# EAGLE design car_sch (EAGLE 6.1)
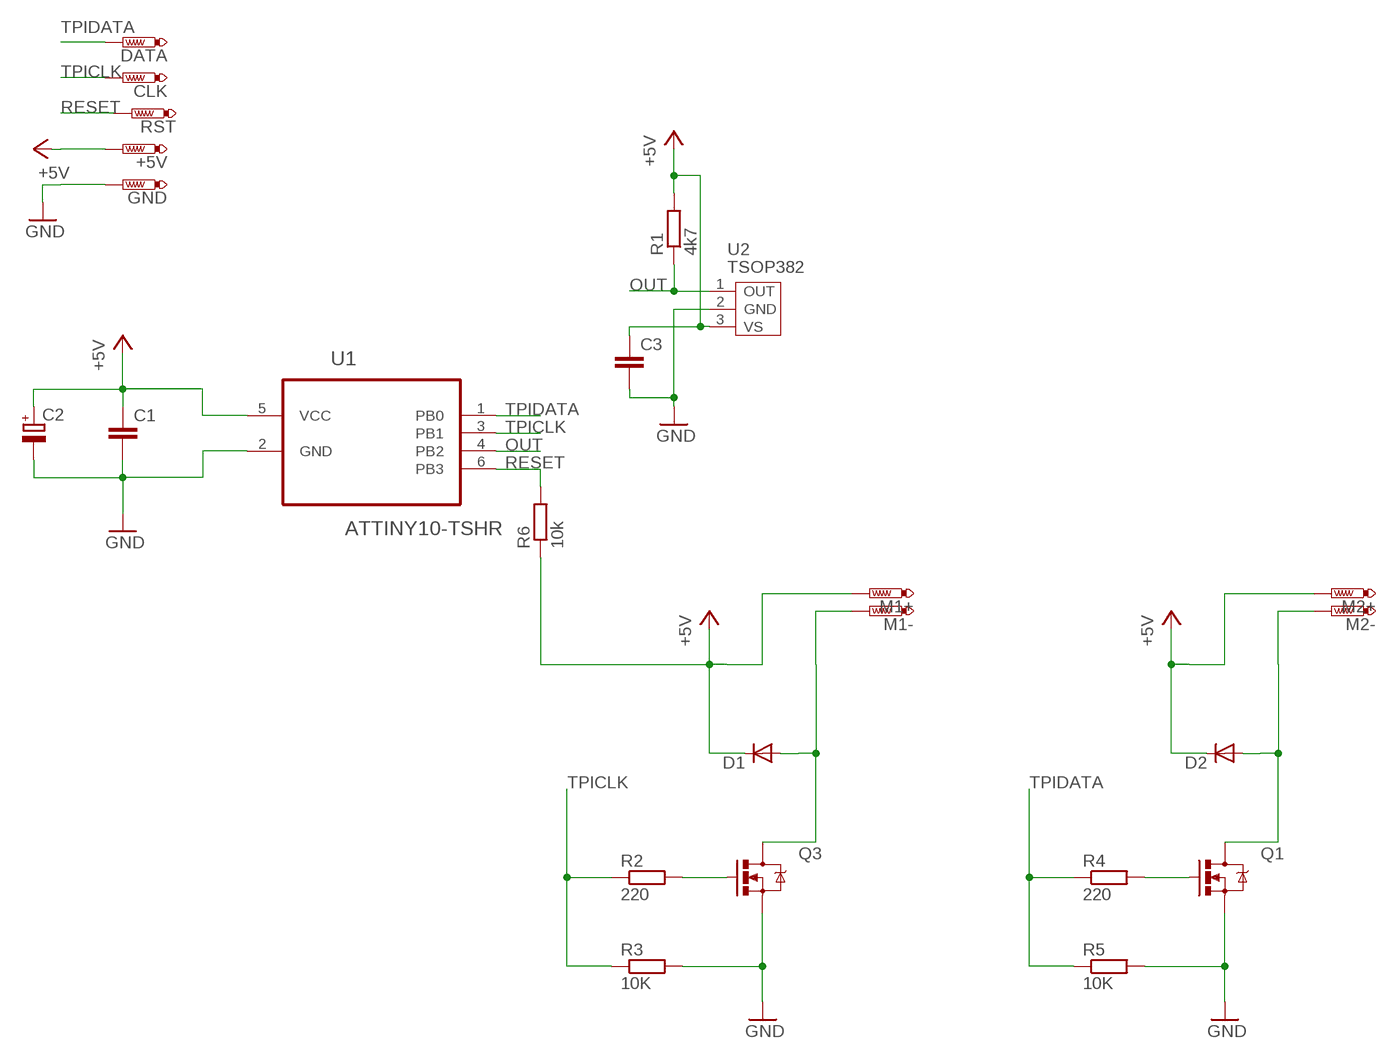
[diagram p0: schematic, sheet 1]

## Parts
+5V  PTR1TP11R  [TP11R]
C1  C-EUC0603  [C0603]
C2  CPOL-EUSMCA  [SMC_A]
C3  C-EUC0603  [C0603]
CLK  PTR1TP11R  [TP11R]
D1  DIODESOD  [SOD-323]
D2  DIODESOD  [SOD-323]
DATA  PTR1TP11R  [TP11R]
GND  PTR1TP11R  [TP11R]
M1+  PTR1TP11R  [TP11R]
M1-  PTR1TP11R  [TP11R]
M2+  PTR1TP11R  [TP11R]
M2-  PTR1TP11R  [TP11R]
Q1  MOSFET-NCHANNELBSS123LT1G  [SOT23]
Q3  MOSFET-NCHANNELBSS123LT1G  [SOT23]
R1  4k7  R-EU_R0603  [R0603]
R2  220  R-EU_R0603  [R0603]
R3  10K  R-EU_R0603  [R0603]
R4  220  R-EU_R0603  [R0603]
R5  10K  R-EU_R0603  [R0603]
R6  10k  R-EU_R0603  [R0603]
RST  PTR1TP11R  [TP11R]
U1  ATTINY10-TSHR  [SOT95P280X145-6N]
U2  TSOP382  [3P-2.54-4.8X5X6.95H]

## Nets
+5V: +5V.TP C1.1 C2.+ C3.1 D1.1(C) D2.1(C) M1+.TP M2+.TP R1.2 R6.1 U1.5(VCC) U2.3(VS)
GND: C1.2 C2.- C3.2 GND.TP Q1.2(S) Q3.2(S) R3.2 R5.2 U1.2(GND) U2.2(GND)
N$1: Q1.1(G) R4.2
N$2: D2.2(A) M2-.TP Q1.3(D)
N$4: Q3.1(G) R2.2
N$5: D1.2(A) M1-.TP Q3.3(D)
OUT: R1.1 U1.4(PB2) U2.1(OUT)
RESET: R6.2 RST.TP U1.6(PB3)
TPICLK: CLK.TP R2.1 R3.1 U1.3(PB1)
TPIDATA: DATA.TP R4.1 R5.1 U1.1(PB0)

## Library data of the parts
+5V CLK DATA GND M1+ M1- M2+ M2- RST = testpad:PTR1: TEST PIN
C1 C3 = resistor:C-EU: CAPACITOR, European symbol
C2 = resistor:CPOL-EU: POLARIZED CAPACITOR, European symbol
D1 D2 = SparkFun-DiscreteSemi:DIODE: Diode These are standard reverse protection diodes and small signal diodes. SMA package can handle up to about 1A. SOD-323 can handle about 200mA. What the SOD-323 package when ordering, there are some mfgs out there that are 5-pin packages.; PROD_ID: DIO-09646
Q1 Q3 = SparkFun-DiscreteSemi:MOSFET-NCHANNEL: Common NMOSFET Parts MFG P/N Store ID Prod ID FDD8780 TRANS-09984 SI7820DN TRANS-11055 FDS6630A IC-08089 2N7002PW TRANS-11151 FQP30N06L COM-10213 TRANS-10060 BSS123LT1G TRANS-08345 BSS138 TRANS-00830 BS170 2N7000; PROD_ID: TRANS-08345
R1-R6 = resistor:R-EU_: RESISTOR, European symbol
U1 = Atmel_By_element14_Batch_1:ATTINY10-TSHR: 8-bit Microcontroller with In-System Programmable Flash; MPN: ATTINY10-TSHR; OC_FARNELL: 1748538; OC_NEWARK: 26R5645; PACKAGE: SOT-23-6; SUPPLIER: Atmel
U2 = IC:TSOP382: IR Receiver Modules for Remote Control Systems

## Board
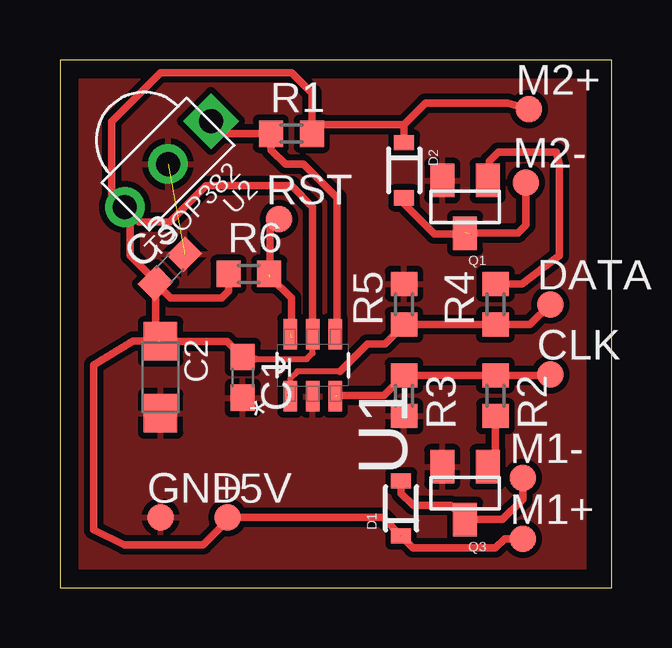
[diagram p1: board, top side]

Size 23 x 22 mm. Coordinates in mm from the lower left corner, seen from the top.
Outline: 0,0 23,0 23,22 0,22 0,0
Copper layers (1*16): Top 0.035mm / dielectric 1.5mm / Bottom 0.035mm
Design rules: minimum track width 10mil, minimum drill 24mil, track to track 8mil, track to pad 8mil, pad to pad 8mil, via to via 8mil, smd to smd 8mil, copper to edge 30mil, drill to drill 8mil, minimum pad ring 10mil, minimum via ring 8mil, stop-mask expansion 4mil, vias tented up to drill 0mil, thermal gap 10mil

### Footprints (pad centres in the part's own frame; a part is rotated, then mirrored left to right if it is on the bottom)
TP11R = smd 1.1 x 1.1: TP 0,0
C0603 = smd 1.1 x 1: 1 -0.85,0; 2 0.85,0
SMC_A = smd 1.6 x 1.4: + -1.5,0; - 1.5,0
SOD-323 = smd 0.63 x 0.83: 1 -1.15,0; 2 1.15,0
SOT23 = smd 1 x 1.4: 1 -0.95,-1.1; 2 0.95,-1.1; 3 0,1.1
R0603 = smd 1 x 1.1: 1 -0.85,0; 2 0.85,0
SOT95P280X145-6N = smd 1.27 x 0.559: 1 -1.295,0.94; 2 -1.295,0; 3 -1.295,-0.94; 4 1.295,-0.94; 5 1.295,0; 6 1.295,0.94
3P-2.54-4.8X5X6.95H = drill 1 pad 1.65 square: 1 -2.54,0 | drill 1 pad 1.65: 2 0,0; 3 2.54,0

### Placement (x,y rotation side)
+5V  6.99,2.92 0 top
C1  7.62,8.76 270 top
C2  4.19,8.76 270 top
C3  4.59,13.3 45 top
CLK  20.45,8.89 0 top
D1  14.22,3.3 90 top
D2  14.35,17.4 270 top
DATA  20.45,11.81 0 top
GND  4.19,2.92 0 top
M1+  19.3,2.03 0 top
M1-  19.3,4.57 0 top
M2+  19.56,19.94 0 top
M2-  19.43,16.89 0 top
Q1  16.89,15.88 180 top
Q3  16.89,3.94 180 top
R1  9.65,18.92 0 top
R2  18.16,8 270 top
R3  14.35,8 270 top
R4  18.16,11.81 90 top
R5  14.35,11.81 90 top
R6  7.87,13.08 0 top
RST  9.14,15.37 0 top
U1  10.54,9.27 90 top
U2  4.5,17.66 225 top

### Tracks (layer width: path | path; a pad name or v marks a point on that pad's centre or on a via)
+5V  (2 unrouted)
  Top 0.254: 8.13,9.53 9.65,9.53 9.78,9.53 10.29,9.53 10.54,9.78 U1.5
  Top 0.305: M2+.TP 18.67,20.19 15.24,20.19 14.35,19.3 | 14.35,19.3 D2.1 | D1.1 14.72,1.65 18.16,1.65 18.54,2.03 M1+.TP | R6.1 7.02,12.36 6.73,12.06 4.62,12.06 C3.1 | C3.1 3.99,10.47 C2.+ | C2.+ 6.97,10.26 C1.1 7.91,9.61 8.13,9.53 | C3.1 3.99,12.78 2.92,13.84 2.92,15.65 U2.3 2.16,16.41 2.16,19.43 4.19,21.46 9.65,21.46 10.5,20.61 R1.2 10.88,19.3 14.35,19.3 | U1.5 10.54,15.88 9.65,16.76 6.1,16.76 4.57,15.24 3.3,15.24 2.67,15.88 | 4.06,10.29 4.19,10.16 | D1.1 13.46,2.92 +5V.TP 6.99,2.79 5.97,1.78 2.67,1.78 1.4,2.41 1.4,9.27 3.05,10.29 4.17,10.29 C2.+
GND  (1 unrouted)
  pour Top (isolate 0.254): 0.17,21.9 21.9,21.9 21.9,0.13 0.13,0.13
N$1
  Top 0.305: Q1.1 17.91,17.04 17.91,17.78 18.29,18.16 20.7,18.16 20.83,17.65 20.83,13.84 19.27,12.66 R4.2
N$2  (1 unrouted)
  Top 0.305: M2-.TP 19.43,15.11 19.09,14.78 Q1.3 | D2.2 14.35,16 15.62,14.73 17.14,14.73
N$4
  Top 0.305: Q3.1 18.16,5.36 R2.2
N$5
  Top 0.305: M1-.TP 19.3,3.68 18.46,2.84 Q3.3 16.3,3.43 14.73,3.43 14.22,3.94 D1.2
OUT
  Top 0.305: U2.1 6.83,18.92 R1.1 8.8,18.25 9.4,17.65 10.16,17.65 11.56,16.26 11.56,10.64 U1.4
RESET  (2 unrouted)
  Top 0.305: RST.TP 8.76,14.99 8.76,12.95 9.65,12.06 9.65,10.41
TPICLK  (1 unrouted)
  Top 0.305: 11.56,8 13.5,8 R3.1 R2.1 20.41,8.85 CLK.TP
TPIDATA
  Top 0.254: 11.68,9.02 9.91,9.02 9.6,8.71 U1.1
  Top 0.305: 11.68,9.02 12.83,10.16 13.55,10.16 R5.1 R4.1 19.6,10.96 DATA.TP